# EAGLE design CHIP_tzatziffy_v7 (EAGLE 7.7.0)
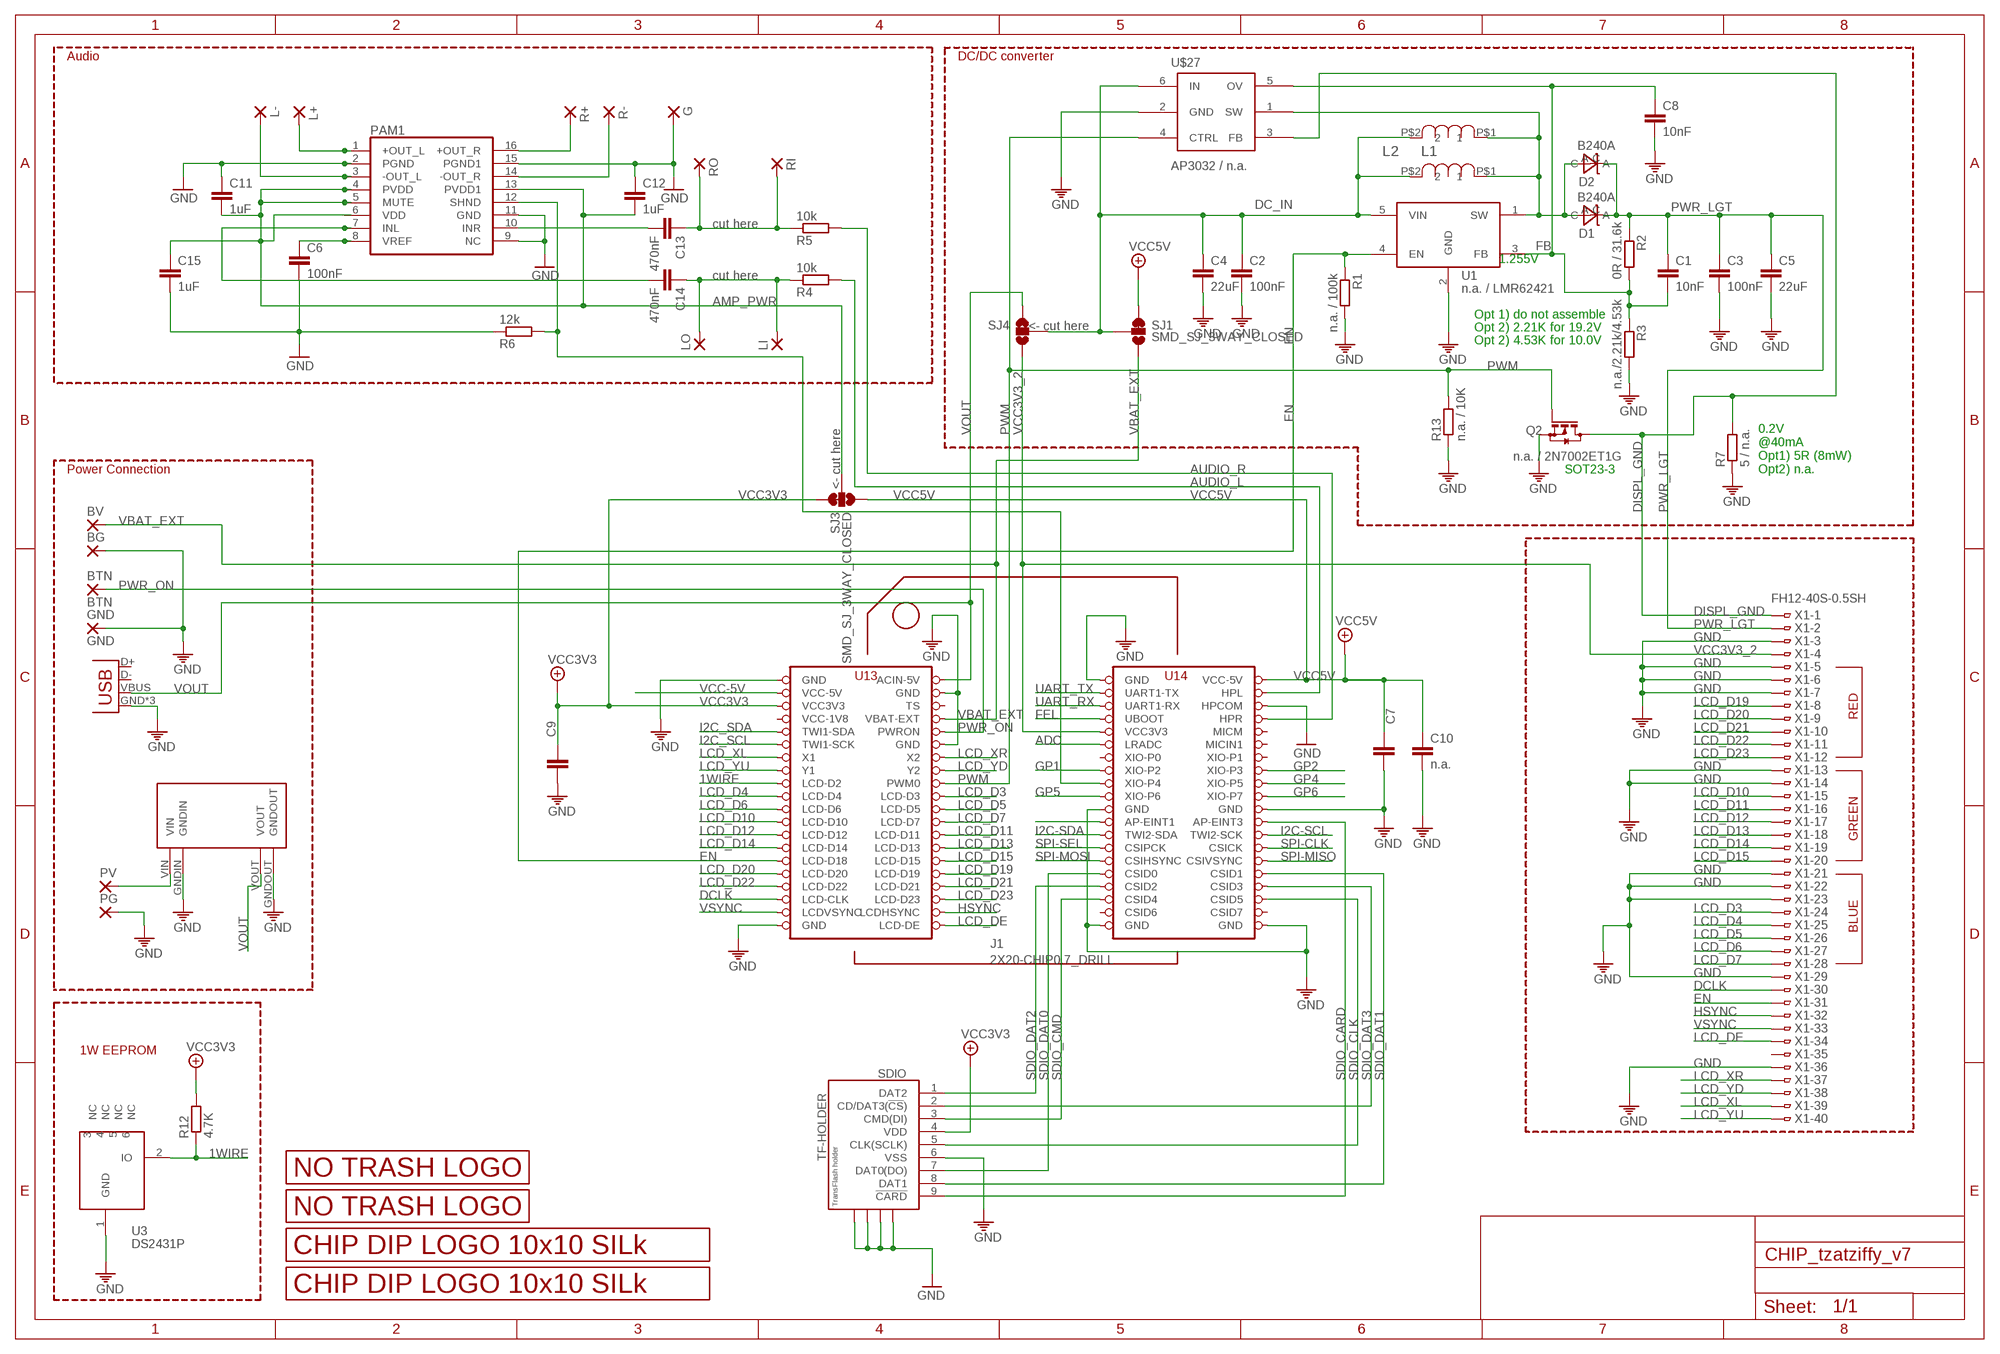
[diagram p0: schematic, sheet 1]

## Parts
BG  1,6/0,8  [1,6/0,8]
BTN  BTN  SMD2  [SMD1,27-2,54]
BV  1,6/0,8  [1,6/0,8]
C1  10nF  C-EUC0805  [C0805]
C2  100nF  C-EUC0805  [C0805]
C3  100nF  C-EUC0805  [C0805]
C4  22uF  C-EUC1206  [C1206]
C5  22uF  C-EUC1206  [C1206]
C6  100nF  C-EUC0805  [C0805]
C7  n.a.  C-EUC0805  [C0805]
C8  10nF  C-EUC0805  [C0805]
C9  n.a.  C-EUC0805  [C0805]
C10  n.a.  C-EUC0805  [C0805]
C11  1uF  C-EUC0805  [C0805]
C12  1uF  C-EUC0805  [C0805]
C13  470nF  C-EUC0805  [C0805]
C14  470nF  C-EUC0805  [C0805]
C15  1uF  C-EUC0805  [C0805]
D1  B240A  DIODE_SCHTKY_B240  [DO-214AC]
D2  B240A  DIODE_SCHTKY_B240  [DO-214AC]
G  1,6/0,8  [1,6/0,8]
GND  GND  SMD2  [SMD1,27-2,54]
J1  2X20-CHIP0.7_DRILL  [2X20CHIP_NOOFFSET-TH_0.7]
L1  SRN6045-100M  [SRN6045]
L2  SRN6045-100M  [SRN6045]
L+  1,6/0,8  [1,6/0,8]
L-  1,6/0,8  [1,6/0,8]
LI  1,6/0,8  [1,6/0,8]
LO  1,6/0,8  [1,6/0,8]
PAM1  PAM8403  [SOP-16]
PG  1,6/0,8  [1,6/0,8]
PV  1,6/0,8  [1,6/0,8]
Q2  n.a. / 2N7002ET1G  BSS123  [SOT23]
R1  n.a. / 100k  R-EU_M0805  [M0805]
R2  0R / 31.6k  R-EU_M0805  [M0805]
R3  n.a./2.21k/4.53k  R-EU_M0805  [M0805]
R4  10k  R-EU_R0805  [R0805]
R5  10k  R-EU_R0805  [R0805]
R6  12k  R-EU_R0805  [R0805]
R7  5 / n.a.  R-EU_M0805  [M0805]
R12  4.7K  R-EU_M0805  [M0805]
R13  n.a. / 10K  R-EU_M0805  [M0805]
R+  1,6/0,8  [1,6/0,8]
R-  1,6/0,8  [1,6/0,8]
RI  1,6/0,8  [1,6/0,8]
RO  1,6/0,8  [1,6/0,8]
SDIO  TF-HOLDER  [TF-PULL]
SJ1  SMD_SJ_3WAY_CLOSED  [SMD_SJ_3WAY_CLOSED]
SJ3  SMD_SJ_3WAY_CLOSED  [SMD_SJ_3WAY_CLOSED]
SJ4  SMD_SJ_3WAY_OPENT  [SMD_SJ_3WAY_OPEN]
U1  n.a. / LMR62421  LMR62421  [SOT23-5]
U3  DS2431P  [TSOC6]
U$2  LOGO_10X10_SILK  [LOGO2_10X10_SILK]
U$3  LOGO_NO_TRASHROHS  [LOGO_ROHS_SYM]
U$4  LOGO_NO_TRASHNO_TRASH  [LOGO_ROHS_NO_TRASH]
U$5  LOGO_10X10_SILK  [LOGO2_10X10_SILK]
U$10  MP1584EN_FRAMELESS  [MP1584EN_FRAMELESS]
U$27  AP3032 / n.a.  AP3032  [SOT23-6]
USB  USBUSB-MICROB-SMT-DIP  [USB-MICROB-SMT-DIP]
X1  FH12-40S-0.5SH  [FH12-40S-0.5SH]

## Nets
1WIRE: J1.LCD-D2 R12.1 U3.2(IO)
ADC: J1.LRADC
AMP_PWR: C11.2 C12.2 C15.1 PAM1.4(PVDD) PAM1.5(MUTE) PAM1.6(VDD) PAM1.13(PVDD1) SJ3.2
AUDIO_L: J1.HPL R4.2
AUDIO_R: J1.HPR R5.2
DC_IN: C2.1 C4.1 L1.P$2 L2.P$2 SJ1.2 SJ4.2 U1.5(VIN) U$27.6(IN)
DCLK: J1.LCD-CLK X1.30
DISPL_GND: Q2.3(D) R7.2 U$27.3(FB) X1.1
EN: J1.LCD-D18 R1.1 U1.4(EN) X1.31
FB: C1.2 C8.1 R2.2 R3.1 U1.3(FB) U$27.5(OV)
FEL: J1.FEL(UBOOT)
GND: BG.1(P) C2.2 C3.2 C4.2 C5.2 C6.2 C7.2 C8.2 C9.2 C10.2 C11.1 C12.1 C15.2 G.1(P) GND.1(P) J1.GND@1(GND) J1.GND@2(GND) J1.GND@3(GND) J1.GND@4(GND) J1.GND@5(GND) J1.GND@6(GND) J1.GND@7(GND) J1.GND@8(GND) J1.GND@10(GND) J1.HPCOM PAM1.2(PGND) PAM1.9(NC) PAM1.11(GND) PAM1.15(PGND1) PG.1(P) Q2.2(S) R1.2 R3.2 R6.1 R7.1 R13.1 SDIO.6(VSS) SDIO.S1 SDIO.S2 SDIO.S3 SDIO.S4 U1.2(GND) U3.1(GND) U$10.GNDIN U$10.GNDOUT U$27.2(GND) USB.GND USB.MT1(GND) USB.MT2(GND) X1.3 X1.5 X1.6 X1.7 X1.13 X1.14 X1.21 X1.22 X1.23 X1.29 X1.36
GP1: J1.XIO-P2
GP2: J1.XIO-P3
GP3: J1.XIO-P4 PAM1.12(SHND) R6.2
GP4: J1.XIO-P5
GP5: J1.XIO-P6
GP6: J1.XIO-P7
HSYNC: J1.LCD-HSYNC(LCDHSYNC) X1.32
I2C-SCL: J1.TWI2-SCK
I2C-SDA: J1.TWI2-SDA
I2C_SCL: J1.TWI1-SCK
I2C_SDA: J1.TWI1-SDA
INL: C14.2 PAM1.7(INL)
INR: C13.2 PAM1.10(INR)
KPD_INT: J1.AP-EINT1
L+OUT: L+.1(P) PAM1.1(+OUT_L)
L-OUT: L-.1(P) PAM1.3(-OUT_L)
LCD_D3: J1.LCD-D3 X1.24
LCD_D4: J1.LCD-D4 X1.25
LCD_D5: J1.LCD-D5 X1.26
LCD_D6: J1.LCD-D6 X1.27
LCD_D7: J1.LCD-D7 X1.28
LCD_D10: J1.LCD-D10 X1.15
LCD_D11: J1.LCD-D11 X1.16
LCD_D12: J1.LCD-D12 X1.17
LCD_D13: J1.LCD-D13 X1.18
LCD_D14: J1.LCD-D14 X1.19
LCD_D15: J1.LCD-D15 X1.20
LCD_D19: J1.LCD-D19 X1.8
LCD_D20: J1.LCD-D20 X1.9
LCD_D21: J1.LCD-D21 X1.10
LCD_D22: J1.LCD-D22 X1.11
LCD_D23: J1.LCD-D23 X1.12
LCD_DE: J1.LCD-DE X1.34
LCD_XL: J1.X1 X1.39
LCD_XR: J1.X2 X1.37
LCD_YD: J1.Y2 X1.38
LCD_YU: J1.Y1 X1.40
N$38: C6.1 PAM1.8(VREF)
N$41: C14.1 LI.1(P) LO.1(P) R4.1
N$43: C13.1 R5.1 RI.1(P) RO.1(P)
PWM: J1.PWM0 Q2.1(G) R13.2 U$27.4(CTRL)
PWR_IN: PV.1(P) U$10.VIN
PWR_LGT: C1.1 C3.1 C5.1 D1.C D2.C R2.1 X1.2
PWR_ON: BTN.1(P) J1.PWRON
R+OUT: PAM1.16(+OUT_R) R+.1(P)
R-OUT: PAM1.14(-OUT_R) R-.1(P)
SDIO_CARD: J1.AP-EINT3 SDIO.9(!CARD)
SDIO_CLK: J1.CSID5 SDIO.5(CLK(SCLK))
SDIO_CMD: J1.CSID4 SDIO.3(CMD(DI))
SDIO_DAT0: J1.CSID0 SDIO.7(DAT0(DO))
SDIO_DAT1: J1.CSID1 SDIO.8(DAT1)
SDIO_DAT2: J1.CSID2 SDIO.1(DAT2)
SDIO_DAT3: J1.CSID3 SDIO.2(CD/DAT3(!CS!))
SPI-CLK: J1.CSICK
SPI-MISO: J1.CSIVSYNC
SPI-MOSI: J1.CSIHSYNC
SPI-SEL: J1.CSIPCK
UART_RX: J1.UART1-RX
UART_TX: J1.UART1-TX
VBAT_EXT: BV.1(P) J1.BAT(VBAT-EXT) SJ1.3
VCC3V3: C9.1 J1.VCC3V3 R12.2 SDIO.4(VDD) SJ3.1
VCC3V3_2: J1.VCC3V3@1(VCC3V3) SJ4.3 X1.4
VCC5V: C7.1 C10.1 J1.VCC5V@1(VCC-5V) SJ1.1 SJ3.3
VCC-5V: J1.VCC5V@0(VCC-5V)
VOUT: J1.CHG-IN(ACIN-5V) SJ4.1 U$10.VOUT USB.VBUS
VREG_OUTPUT: D1.A D2.A L1.P$1 L2.P$1 U1.1(SW) U$27.1(SW)
VSYNC: J1.LCD-VSYNC(LCDVSYNC) X1.33
Unconnected: J1.CSID6 J1.CSID7 J1.MICIN1 J1.MICM J1.TS J1.XIO-P0 J1.XIO-P1 U3.3(NC) U3.4(NC) U3.5(NC) U3.6(NC) USB.D+ USB.D- X1.35

## Notes on the sheet
- Audio | DC/DC converter
- cut here
- 1.255V
- cut here
- Opt 1) do not assemble
- <- cut here | Opt 2) 2.21K for 19.2V
- Opt 2) 4.53K for 10.0V
- <- cut here
- Power Connection | SOT23-3
- 0.2V
  @40mA
  Opt1) 5R (8mW)
  Opt2) n.a.
- RED
- GREEN
- BLUE
- 1W EEPROM

## Power pins joined to a net without a drawn wire
VCC-1V8: J1.VCC1V8(VCC-1V8)

## Library data of the parts
BG BV G L+ L- LI LO PG PV R+ R- RI RO = wirepad:1,6/0,8: THROUGH-HOLE PAD
BTN GND = wirepad:SMD2: SMD PAD
C1-C15 = rcl:C-EU: CAPACITOR, European symbol
D1 D2 = Keyboard v0_5:DIODE_SCHTKY_B240; DESCRIPTION: DIODE SMD General Purpose 400V 1A 1.4W RoHS DO-214AC; FOOTPRINT: DO-214AC; LINK: http://www.digikey.com/product-detail/en/B240A-13-F/B240A-FDICT-ND/717810; MFG: DIGIKEY; MFG_PN: B240A-FDICT-ND; PART_TYPE: DIODE; PRICE: 0.11; VENDOR: DIODES; VENDOR_PART_NUMBER: B240A-13-F
J1 = JKW_CHIP:2X20-CHIP: Through hole layout with chip reference
L1 L2 = Keyboard v0_5:SRN6045-100M; DESCRIPTION: power inductor 10uH 2.5A 58.6 mohm; FOOTPRINT: SRN6045; LINK: http://www.digikey.com/product-detail/en/SRN6045-100M/SRN6045-100MTR-ND/2756120; MFG: DIGIKEY; MFG_PN: SRN6045-100MTR-ND; PART_TYPE: IND; PRICE: 0.15; TOLLERANCE: ±20%; VENDOR: BOURNS; VENDOR_PART_NUMBER: SRN6045-100M
PAM1 = JKW_CHIP:PAM8403: Dual channel audio amplifier IC - PAM8403
Q2 = transistor-small-signal:BSS123: N-CHANNEL MOS FET
R1-R7 R12 R13 = rcl:R-EU_: RESISTOR, European symbol
SDIO = JKW_CHIP:TF-HOLDER: TF / Micro SD socket is PUSH-PUSH type, the card can be pushed into and auto locked and pushed out by simply press the card. Surface Mounting type.
SJ1 SJ3 = JKW_CHIP:SMD_SJ_3WAY_CLOSED
SJ4 = JKW_CHIP:SMD_SJ_3WAY_OPEN: Solder Jumper 2 way solder jumper
U1 = PocketCHIP-Components-v0.7:LMR62421; DESCRIPTION: dc/dc step up, 2.1A, 1.6mhz, SOT-23-5; FOOTPRINT: SOT23-5; LINK: http://www.digikey.com/product-detail/en/LMR62421XMFE%2FNOPB/LMR62421XMFE%2FNOPBCT-ND/2777085; MFG: DIGIKEY; MFG_PN: LMR62421XMFE/NOPBCT-ND; PART_TYPE: IC; PRICE: 0.8; VENDOR: TEXAS INSTRUMENTS; VENDOR_PART_NUMBER: LMR62421XMFE/NOPB
U3 = Keyboard v0_5:DS2431: 1024-Bit EEPROM This chip provides a 4x256 Bit EEPROM, which can be programmed@5V. Write protection and OTP emulation are available, too. Author: Jan Kandziora <jjj@gmx.de>; DESCRIPTION: IC, 1024-Bit, 1-Wire EEPROM, TSOC6; FOOTPRINT: TSOC6; LINK: http://www.digikey.com/product-detail/en/DS2431P%2BT%26R/DS2431P%2BT%26RCT-ND/3647900; MFG: DIGIKEY; MFG_PN: DS2431P+T&RCT-ND; PART_TYPE: IC; PRICE: 0.98; VENDOR: MAXIM; VENDOR_PART_NUMBER: DS2431P+T&R
U$2 U$5 = JKW_CHIP:LOGO_10X10_SILK
U$3 U$4 = JKW_CHIP:LOGO_NO_TRASH
U$10 = JKW_CHIP:MP1584EN_FRAMELESS
U$27 = JKW_CHIP:AP3032
USB = Spark:USB
X1 = Keyboard v0_5:FH12-40S-0.5S: 0.5mm Pitch Connectors For FPC/FFC Source: Data sheet <http://www.hirose.co.jp/cataloge_hp/e58605370.pdf>; DESCRIPTION: CON ffc smd, bottom contact 40pos, 0.50mm R/A; FOOTPRINT: FH12-40S-0.5SH; LINK: http://www.digikey.com/product-detail/en/FH12-40S-0.5SH(55)/HFJ140CT-ND/1110388; MFG: DIGIKEY; MFG_PN: HFJ140CT-ND; VENDOR: HIROSE; VENDOR_PART_NUMBER: FH12-40S-0.5SH(55)

## Board
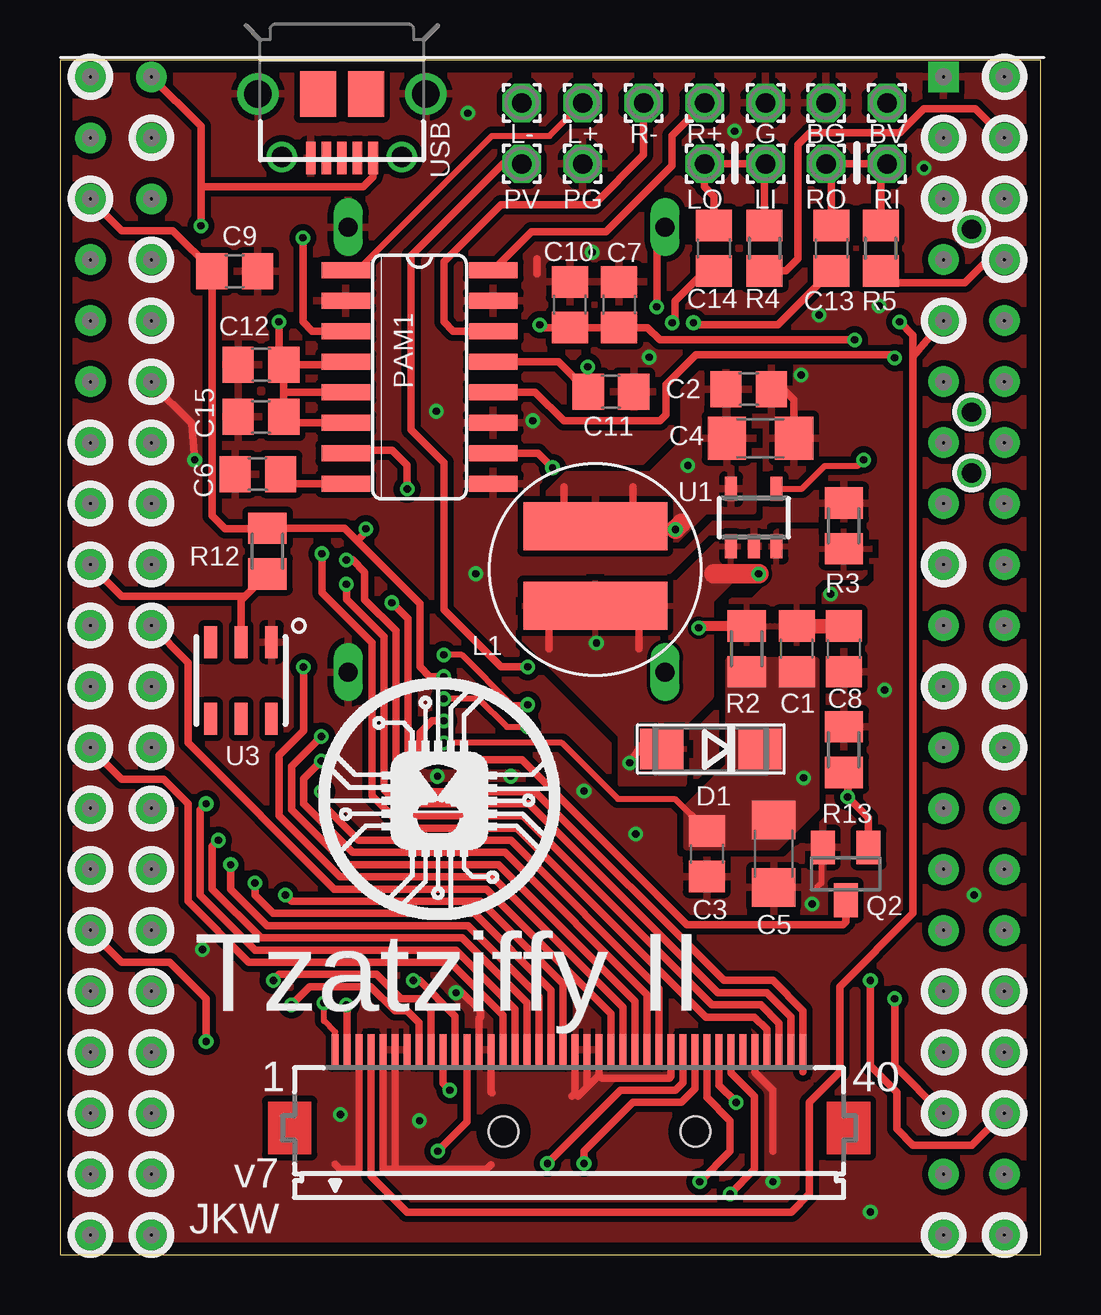
[diagram p1: board, top side]
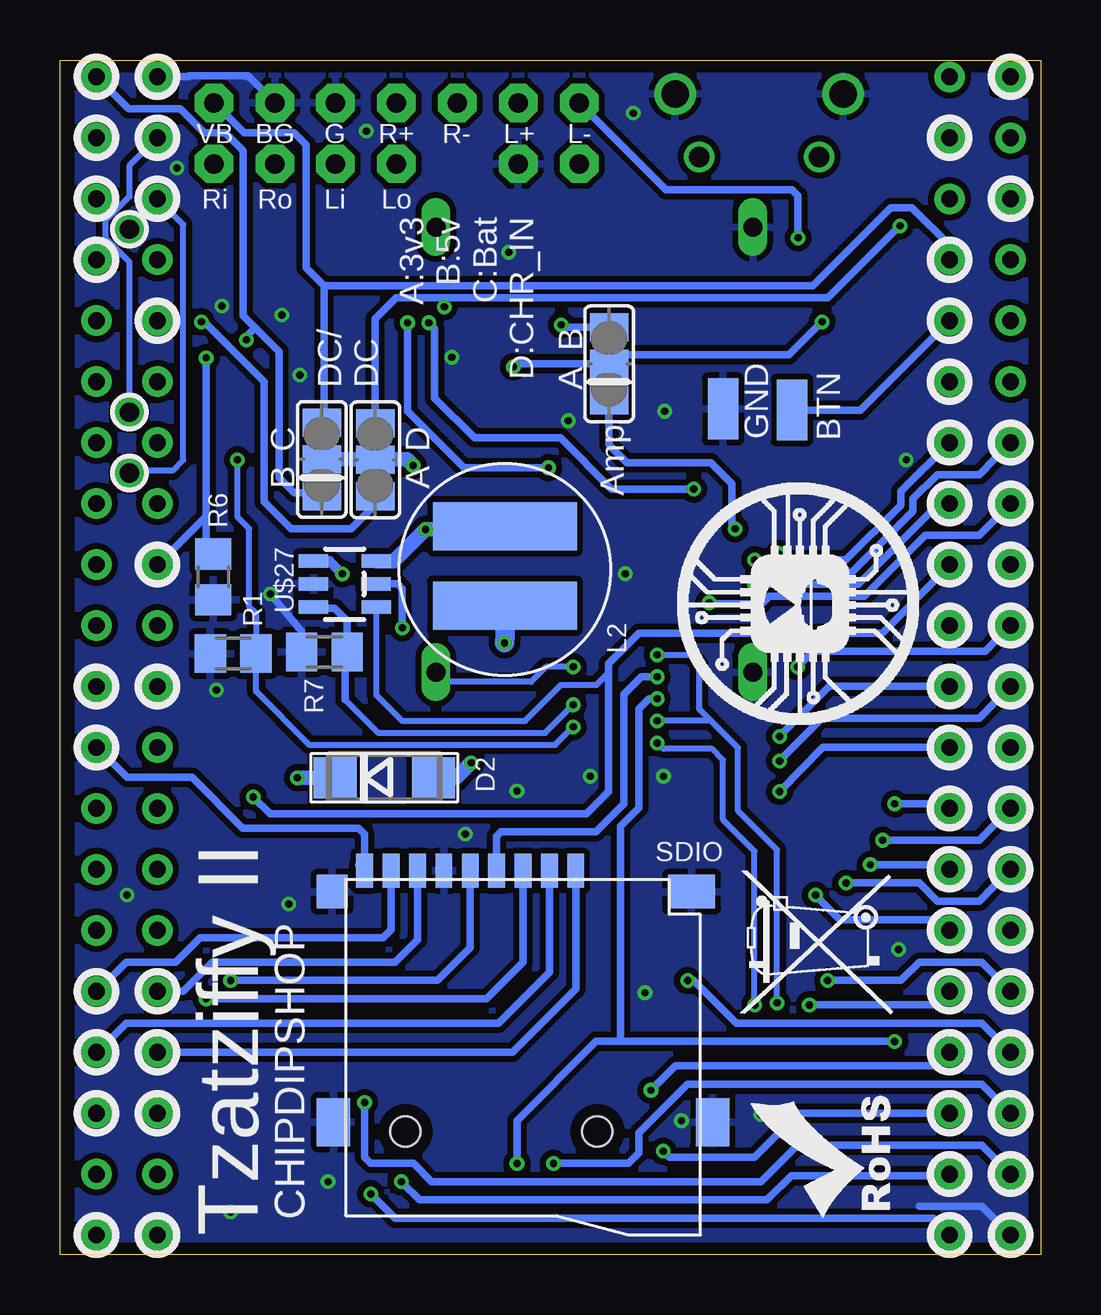
[diagram p2: board, bottom side, seen from below]

Size 40.89 x 49.78 mm. Coordinates in mm from the lower left corner, seen from the top.
Outline: 0,0 40.89,0 40.89,49.78 0,49.78 0,0
Copper layers (1*16): Top 0.035mm / dielectric 1.6mm / Bottom 0.035mm
Design rules "Elecrow_2-layer_PCB_eagle_rule": minimum track width 6mil, minimum drill 12mil, track to track 6mil, track to pad 6mil, pad to pad 6mil, via to via 8mil, smd to smd 0mil, copper to edge 20mil, drill to drill 10mil, minimum pad ring 6mil, minimum via ring 6mil, stop-mask expansion 0mil, vias tented up to drill 100mil, thermal gap 10mil

### Footprints (pad centres in the part's own frame; a part is rotated, then mirrored left to right if it is on the bottom)
1,6/0,8 = drill 0.813 pad 1.6 octagon: 1 0,0
SMD1,27-2,54 = smd 1.27 x 2.54: 1 0,0
C0805 = smd 1.3 x 1.5: 1 -0.95,0; 2 0.95,0
C1206 = smd 1.6 x 1.8: 1 -1.4,0; 2 1.4,0
DO-214AC = smd 1.8 x 1.7: A 2.05,0; C -2.05,0
2X20CHIP_NOOFFSET-TH_0.7 = drill 0.7 pad 1.27: AP-EINT1 15.22,-3.75; AP-EINT3 17.76,-3.75; BAT -17.8,16.57; CHG-IN -17.8,24.19; CSICK 17.76,-8.83; CSID0 15.22,-13.91; CSID1 17.76,-13.91; CSID2 15.22,-16.45; CSID3 17.76,-16.45; CSID4 15.22,-18.99; CSID5 17.76,-18.99; CSID6 15.22,-21.53; CSID7 17.76,-21.53; CSIHSYNC 15.22,-11.37; CSIPCK 15.22,-8.83; CSIVSYNC 17.76,-11.37; FEL 15.22,16.57; GND@1 -17.8,11.49; GND@2 -20.34,-24.07; GND@4 17.76,-1.21; GND@5 17.76,-24.07; GND@6 15.22,-24.07; GND@7 15.22,-1.21; GND@10 -17.8,21.65; HPCOM 17.76,19.11; HPL 17.76,21.65; HPR 17.76,16.57; LCD-CLK -20.34,-18.99; LCD-D2 -20.34,3.87; LCD-D3 -17.8,1.33; LCD-D4 -20.34,1.33; LCD-D5 -17.8,-1.21; LCD-D6 -20.34,-1.21; LCD-D7 -17.8,-3.75; LCD-D10 -20.34,-3.75; LCD-D11 -17.8,-6.29; LCD-D12 -20.34,-6.29; LCD-D13 -17.8,-8.83; LCD-D14 -20.34,-8.83; LCD-D15 -17.8,-11.37; LCD-D18 -20.34,-11.37; LCD-D19 -17.8,-13.91; LCD-D20 -20.34,-13.91; LCD-D21 -17.8,-16.45; LCD-D22 -20.34,-16.45; LCD-D23 -17.8,-18.99; LCD-DE -17.8,-24.07; LCD-HSYNC -17.8,-21.53; LCD-VSYNC -20.34,-21.53; LRADC 15.22,11.49; MICIN1 17.76,11.49; MICM 17.76,14.03; PWM0 -17.8,3.87; PWRON -17.8,14.03; TS -17.8,19.11; TWI1-SCK -20.34,11.49; TWI1-SDA -20.34,14.03; TWI2-SCK 17.76,-6.29; TWI2-SDA 15.22,-6.29; UART1-RX 15.22,19.11; UART1-TX 15.22,21.65; VCC1V8 -20.34,16.57; VCC3V3 -20.34,19.11; VCC3V3@1 15.22,14.03; VCC5V@0 -20.34,21.65; VCC5V@1 17.76,24.19; X1 -20.34,8.95; X2 -17.8,8.95; XIO-P0 15.22,8.95; XIO-P1 17.76,8.95; XIO-P2 15.22,6.41; XIO-P3 17.76,6.41; XIO-P4 15.22,3.87; XIO-P5 17.76,3.87; XIO-P6 15.22,1.33; XIO-P7 17.76,1.33; Y1 -20.34,6.41; Y2 -17.8,6.41 | drill 0.7 pad 1.27 square: GND@3 -20.34,24.19; GND@8 15.22,24.19
SRN6045 = smd 2 x 6: P$1 1.5,0; P$2 -1.8,0
SOP-16 = smd 0.66 x 2.032: 1 -4.445,-3.073; 2 -3.175,-3.073; 3 -1.905,-3.073; 4 -0.635,-3.073; 5 0.635,-3.073; 6 1.905,-3.073; 7 3.175,-3.073; 8 4.445,-3.073; 9 4.445,3.073; 10 3.175,3.073; 11 1.905,3.073; 12 0.635,3.073; 13 -0.635,3.073; 14 -1.905,3.073; 15 -3.175,3.073; 16 -4.445,3.073
SOT23 = smd 1 x 1.4: 1 -0.95,-1.1; 2 0.95,-1.1; 3 0,1.1
M0805 = smd 1.3 x 1.6: 1 -0.95,0; 2 0.95,0
R0805 = smd 1.3 x 1.5: 1 -0.95,0; 2 0.95,0
TF-PULL = smd 0.7 x 1.4: 1 -2.2,-7.62; 2 -1.1,-7.62; 3 0,-7.62; 4 1.1,-7.62; 5 2.2,-7.62; 6 3.3,-7.62; 7 4.4,-7.62; 8 5.5,-7.62; 9 6.6,-7.62 | smd 1.4 x 2: S1 -7.9,2.85; S2 7.9,2.85 | smd 1.28 x 1.4: S3 7.96,-6.75 | smd 1.95 x 1.4: S4 -7.025,-6.75 | hole 1.25: -3.1,3.25; 4.9,3.25
SMD_SJ_3WAY_CLOSED = smd 1.168 x 1.6: 1 -1.524,0; 2 0,0; 3 1.524,0
SMD_SJ_3WAY_OPEN = smd 1.168 x 1.6: 1 -1.524,0; 2 0,0; 3 1.524,0
SOT23-5 = smd 0.5 x 1: 1 -0.95,-1.2; 2 0,-1.2; 3 0.95,-1.2; 4 0.95,1.2; 5 -0.95,1.2
TSOC6 = smd 0.53 x 1.33: 1 -1.27,-1.6; 2 0,-1.6; 3 1.27,-1.6; 4 1.27,1.6; 5 0,1.6; 6 -1.27,1.6
MP1584EN_FRAMELESS = drill 0.8 long: GNDIN 1.778,14.986; GNDOUT 20.32,14.986; VIN 1.778,1.778; VOUT 20.32,1.778
SOT23-6 = smd 0.559 x 1.219: 1 -0.95,-1.3; 2 0,-1.3; 3 0.965,-1.3; 4 0.965,1.321; 5 0,1.3; 6 -0.95,1.321
USB-MICROB-SMT-DIP = smd 0.4 x 1.35: D+ 0,2.675; D- -0.65,2.675; GND 1.3,2.675; ID 0.65,2.675; VBUS -1.3,2.675 | drill 1.15 pad 1.7: MT1 -3.5,0; MT2 3.5,0 | drill 0.85 pad 1.25: MT3 -2.5,2.625; MT4 2.5,2.625 | smd 1.5 x 1.9: P$1 -1,0; P$2 1,0.01
FH12-40S-0.5SH = smd 0.3 x 1.3: 1 -9.75,3.25; 2 -9.25,3.25; 3 -8.75,3.25; 4 -8.25,3.25; 5 -7.75,3.25; 6 -7.25,3.25; 7 -6.75,3.25; 8 -6.25,3.25; 9 -5.75,3.25; 10 -5.25,3.25; 11 -4.75,3.25; 12 -4.25,3.25; 13 -3.75,3.25; 14 -3.25,3.25; 15 -2.75,3.25; 16 -2.25,3.25; 17 -1.75,3.25; 18 -1.25,3.25; 19 -0.75,3.25; 20 -0.25,3.25; 21 0.25,3.25; 22 0.75,3.25; 23 1.25,3.25; 24 1.75,3.25; 25 2.25,3.25; 26 2.75,3.25; 27 3.25,3.25; 28 3.75,3.25; 29 4.25,3.25; 30 4.75,3.25; 31 5.25,3.25; 32 5.75,3.25; 33 6.25,3.25; 34 6.75,3.25; 35 7.25,3.25; 36 7.75,3.25; 37 8.25,3.25; 38 8.75,3.25; 39 9.25,3.25; 40 9.75,3.25

### Placement (x,y rotation side)
BG  31.93,48 0 top
BTN  10.38,35.2 180 bottom
BV  34.47,48 0 top
C1  30.71,25.25 90 top
C2  28.71,36.08 0 top
C3  26.97,16.71 270 top
C4  29.2,34.03 0 top
C5  29.75,16.71 270 top
C6  8.25,32.53 180 top
C7  23.31,39.59 90 top
C8  32.67,25.25 270 top
C9  7.29,40.98 0 top
C10  21.25,39.59 90 top
C11  22.97,35.96 180 top
C12  8.38,37.08 0 top
C13  32.17,41.94 270 top
C14  27.26,41.94 270 top
C15  8.38,34.91 180 top
D1  27.13,21.08 180 top
D2  27.38,19.88 0 bottom
G  29.41,48 0 top
GND  13.25,35.24 180 bottom
J1  21.61,24.89 0 top
L1  22.32,28.55 270 top
L2  22.35,28.55 270 bottom
L+  21.79,48 0 top
L-  19.25,48 0 top
LI  29.41,45.46 0 top
LO  26.87,45.46 0 top
PAM1  14.99,36.58 270 top
PG  21.79,45.46 0 top
PV  19.25,45.46 0 top
Q2  32.75,15.88 180 top
R1  33.67,25.05 180 bottom
R2  28.63,25.25 90 top
R3  32.67,30.38 90 top
R4  29.37,41.94 270 top
R5  34.21,41.94 270 top
R6  34.5,28.25 90 bottom
R7  29.88,25.12 0 bottom
R12  8.65,29.32 90 top
R13  32.67,21.05 270 top
R+  26.87,48 0 top
R-  24.33,48 0 top
RI  34.47,45.46 0 top
RO  31.93,45.46 0 top
SDIO  21.59,8.38 180 bottom
SJ1  29.98,33.14 90 bottom
SJ3  18,37.12 90 bottom
SJ4  27.75,33.12 270 bottom
U1  28.92,30.72 0 top
U3  7.55,23.93 180 top
U$2  10.79,13.97 0 top
U$3  6.21,1.08 90 bottom
U$4  6.17,10.02 90 bottom
U$5  5.1,22.1 90 bottom
U$10  27,22.5 90 top
U$27  29.03,27.95 270 bottom
USB  11.75,48.38 180 top
X1  21.22,5.29 0 top

### Tracks (layer width: path | path; a pad name or v marks a point on that pad's centre or on a via)
1WIRE
  Top 0.305: J1.LCD-D2 2.58,27.43 7.71,27.43 | 7.71,27.43 R12.1 | U3.2 7.55,27.27 7.71,27.43
AMP_PWR  (via drill 0.3)
  Top 0.305: 9.46,37.21 C12.2 | PAM1.6 9.97,34.67 C15.1 9.33,35.88 | C12.2 9.33,35.88 | PAM1.4 11.79,37.08 C12.2 | v9.12,38.88 9.12,37.29 C12.2 | 18.02,37.25 PAM1.13 20.77,37.21 C11.2 21.62,35.74 22,36.12 v22,37 | PAM1.5 9.4,35.94 9.33,35.88
  Bottom 0.305: v9.12,38.88 10.5,37.5 17.62,37.5 SJ3.2 21.88,37.12 v22,37
AUDIO_L
  Top 0.305: 29,40.88 28.99,40.88 R4.2 29,41 30.25,41 30.75,41.5 30.75,46.25 31.25,46.75 35,46.75 36,47.75 38.16,47.75 J1.HPL
AUDIO_R
  Top 0.305: J1.HPR 38.67,41.46 37.71,40.51 34.19,40.51 R5.2
DC_IN  (via drill 0.3)
  Top 0.305: 21,32 21,31 | 23.88,32 23.88,31
  Top 0.813: v25.65,30.23 25.91,30.48
  Bottom 0.61: 22.52,29.77 22.32,29.98 22.35,29.98 L2.P$2 22.48,30.23 v25.65,30.23 26.98,28.9 U$27.6 | SJ1.2 27.77,33.14 | 27.77,33.14 SJ4.2 | 27.77,33.14 26.42,33.14 v26.17,32.89
  pour Top: 28.88,36.75 26.75,36.75 26,36 26,33.88 24.62,32.5 21.12,32.5 19.5,30.88 19.5,29.5 25.38,29.5 26.88,31 28.88,31
DCLK  (via drill 0.3)
  Top 0.305: X1.30 25.97,7.18 25.65,6.86 23.37,6.86 v20.32,3.81
  Bottom 0.305: J1.LCD-CLK 2.46,7.11 14.73,7.11 16.75,5.09 16.75,4.25 17.19,3.81 v20.32,3.81
DISPL_GND  (via drill 0.3)
  Top 0.254: X1.1 11.47,9.28 11,9.75 v11,10.5 | v16,25 16.75,25 18.83,22.92 v19.5,22.92
  Top 0.305: v16,22.25 15.5,22.25 15,21.75 15,21 15.38,20.62 19.25,20.62 26.12,13.75 32.62,13.75 32.75,13.88 Q2.3
  Bottom 0.254: v11,10.5 11,16.88 12.62,18.5 12.62,21.12 13.75,22.25 | 13.75,22.25 v16,22.25 | v16,25 14.62,25 14.25,24.62 14.25,22.75 13.75,22.25 | 30.38,26.94 U$27.3 | 29,23.12 27.62,21.75 20.67,21.75 v19.5,22.92
  Bottom 0.305: 29,23.12 29,25.05 R7.2 28.93,26.43 29.44,26.94 30.38,26.94
EN  (via drill 0.3)
  Top 0.254: v16,23.17 17.46,23.17 18.62,22 v19.5,22 | U1.4 30.92,31.92 31.88,32.88 33.25,32.88 v33.5,33.12
  Top 0.305: J1.LCD-D18 2.58,12.19 4.57,12.19 6.1,10.67 v6.1,8.89 | X1.31 26.47,6.91 25.91,6.35 23.88,6.35 21.84,4.32 v21.84,3.81
  Bottom 0.254: v33.5,33.12 33.5,30.75 33,30.25 33,27 32.73,26.73 R1.1 | 32.38,24.95 R1.1 | v19.5,22 20.25,21.25 30.5,21.25 32.73,23.48 R1.1
  Bottom 0.305: v6.1,8.89 17.53,8.89 | 17.53,8.89 17.53,17.85 16.75,18.62 16.75,22.75 16.33,23.17 v16,23.17 | 17.53,8.89 18.54,8.89 21.84,5.59 v21.84,3.81
FB  (via drill 0.3)
  Top 0.406: R2.2 26.7,26.2 v26.62,26.12
  Top 0.61: C8.1 C1.2
  Bottom 0.305: U$27.5 26.83,27.95 26.62,27.75 v26.62,26.12
  pour Top: 27.88,26.12 28,25.5 31.38,25.5 31.38,27.88 31.75,28.25 33.38,28.25 33.75,28.62 33.75,30 33.62,30.12 29.88,30.12 29.62,29.88 29.62,28 28.88,27.25 28,27.25 27.88,27.12
GND  (via drill 0.3, 0.8)
  Top 0.254: 31.56,15.31 31.75,15.5 31.75,16.43 Q2.2
  Top 0.305: 13.97,3.56 17.78,3.56 17.97,3.75 | PAM1.2 12.04,39.88 | 3.81,36.32 5.49,34.64 v5.62,33.12 | 11.47,3.77 11.68,3.56 12.45,3.56 12.47,3.58 X1.3 | 13.97,3.56 13.46,3.56 13.47,3.57 X1.5 | X1.6 13.97,3.56 | X1.36 28.97,7.6 29.72,6.86 29.72,4.32 | 16.76,10.92 17.53,10.16 17.53,9.91 17.47,9.85 X1.13 | X1.29 25.47,7.44 25.4,7.37 22.59,7.37 22.47,7.49 | X1.21 21.47,6.74 21.34,6.6 | X1.23 22.47,7.49 | 22.47,7.49 21.97,6.99 | 21.97,6.99 21.59,6.6 | X1.22 21.97,6.99 | X1.14 17.97,6.78 18,6.75 | C4.2 30.6,35.63 30.16,36.08 C2.2 | 19.88,40.88 19.88,41.5
  Bottom 0.305: J1.GND@2 2.46,2.03 5.08,2.03 | 33.01,49.08 33.08,49.08 | BG.1 33.05,49.12 35.5,49.12 35.54,49.08 J1.GND@8 | R7.1 30.82,25.99 v32.13,27.54
  other vias: 24.57,37.4 17.34,28.38 16.99,47.57 21.84,19.32 33.78,1.78 29.72,3.05 24,17.53 38.1,14.99 18.8,19.94 15.74,19.94 14.99,5.59 16.51,10.92 11.68,5.84 38,42.73 34.38,23.54 30.89,36.66 19.71,34.75 28.12,46.82 5.93,12.72 22.19,41.77 15.69,35.15 31.64,39.16 34.15,39.54 36.02,45.29 31.35,14.61
  pour Bottom (isolate 0.254, rank 3): 0.51,49.78 40.13,49.78 40.13,0.25 0.51,0.25
  pour Top (isolate 0.254, rank 3): 0.51,49.78 40.13,49.78 40.13,0.25 0.51,0.25
GP3  (via drill 0.3)
  Top 0.305: v34.8,37.38 34.67,37.5 26.5,37.5 25.25,36.25 25.25,35 25,34.75 21,34.75 19.81,35.94 PAM1.12
  Bottom 0.305: v34.8,37.38 34.8,30.77 | 34.8,30.77 J1.XIO-P4 | R6.2 34.8,29.5 34.8,30.77
HSYNC  (via drill 0.3)
  Top 0.305: 26.97,3.35 v26.67,3.05 27.94,4.31 27.94,5.59 26.97,6.56 X1.32
  Bottom 0.305: J1.LCD-HSYNC 3.85,3.3 10.41,3.3 11.43,2.29 25.91,2.29 v26.67,3.05
INL  (via drill 0.3)
  Top 0.305: PAM1.7 12.04,33.53 13.85,33.53 14.47,32.9 v14.47,31.9 | v25.52,38.83 25.62,38.94 25.62,39.73 26.88,40.99 C14.2
  Bottom 0.305: v14.47,31.9 17.9,31.9 20.04,34.04 23.62,34.04 25.27,35.69 25.27,38.58 v25.52,38.83
INR  (via drill 0.3)
  Top 0.305: v26.4,38.83 26.49,38.75 29.93,38.75 C13.2 | PAM1.10 19.92,33.4 v20.53,32.79
  Bottom 0.305: v26.4,38.83 26.4,35.15 24.04,32.79 v20.53,32.79
L+OUT
  Top 0.254: L+.1 20.41,46.62 18,46.62 12.4,41.02 PAM1.1
  Top 0.305: PAM1.1 12.5,41.02
L-OUT  (via drill 0.3)
  Top 0.305: PAM1.3 10.52,38.48 10.12,38.88 v10.12,42.38
  Bottom 0.305: v10.12,42.38 10.12,44.12 10.38,44.38 15.62,44.38 L-.1
LCD_D3
  Top 0.305: J1.LCD-D3 5.33,24.68 5.33,21.34 11.43,15.24 17.78,15.24 22.97,10.05 X1.24
  Bottom 0.305: 3.85,26.16 J1.LCD-D3
LCD_D4  (via drill 0.3)
  Top 0.305: X1.25 23.47,10.31 18.03,15.75 11.68,15.75 9.14,18.29 9.14,20.82 10.15,21.83 v10.15,24.5
  Bottom 0.305: J1.LCD-D4 2.33,25.15 9.5,25.15 v10.15,24.5
LCD_D5  (via drill 0.3)
  Top 0.305: X1.26 23.97,10.57 18.29,16.26 11.94,16.26 9.65,18.54 9.65,20.35 v10.9,21.6
  Bottom 0.305: J1.LCD-D5 8.82,23.68 v10.9,21.6
LCD_D6  (via drill 0.3)
  Top 0.305: X1.27 24.47,10.83 18.54,16.76 12.19,16.76 10.16,18.8 10.16,19.84 v10.9,20.58
  Bottom 0.305: J1.LCD-D6 2.58,22.35 9.13,22.35 v10.9,20.58
LCD_D7  (via drill 0.3)
  Top 0.305: X1.28 24.97,11.1 18.8,17.27 12.45,17.27 10.92,18.8 v10.9,19.3
  Bottom 0.305: J1.LCD-D7 9.08,21.14 v10.9,19.3
LCD_D10
  Top 0.305: J1.LCD-D10 2.58,19.81 4.32,19.81 5.33,18.8 5.33,14.73 7.87,12.19 16.26,12.19 18.47,9.98 X1.15
LCD_D11  (via drill 0.3)
  Top 0.305: v6.1,18.8 5.84,18.54 5.84,14.99 8.13,12.7 16.51,12.7 18.97,10.24 X1.16
  Bottom 0.305: v6.1,18.8 3.98,18.8 J1.LCD-D11
LCD_D12  (via drill 0.3)
  Top 0.305: v6.6,17.27 6.35,17.02 6.35,15.24 8.38,13.21 16.76,13.21 19.47,10.5 X1.17
  Bottom 0.305: J1.LCD-D12 2.58,17.27 v6.6,17.27
LCD_D13  (via drill 0.3)
  Top 0.305: v7.11,16.26 7.11,15.24 8.64,13.72 17.02,13.72 19.97,10.76 X1.18
  Bottom 0.305: v7.11,16.26 3.98,16.26 J1.LCD-D13
LCD_D14  (via drill 0.3)
  Top 0.305: X1.19 20.47,11.02 17.27,14.22 8.89,14.22 8.13,14.99 v8.13,15.49
  Bottom 0.305: J1.LCD-D14 2.58,14.73 4.32,14.73 5.08,15.49 v8.13,15.49
LCD_D15  (via drill 0.3)
  Top 0.305: X1.20 20.97,11.29 17.53,14.73 9.65,14.73 v9.4,14.99
  Bottom 0.305: v9.4,14.99 8.38,13.97 4.24,13.97 J1.LCD-D15
LCD_D19  (via drill 0.3)
  Top 0.305: X1.8 14.97,9.67 14.48,10.16 13.97,10.16 12.95,11.18 10.41,11.18 v9.65,10.41
  Bottom 0.305: v9.65,10.41 4.36,10.41 J1.LCD-D19
LCD_D20  (via drill 0.3)
  Top 0.305: X1.9 15.47,10.18 14.99,10.67 14.22,10.67 13.21,11.68 9.14,11.68 v8.89,11.43
  Bottom 0.305: J1.LCD-D20 2.46,12.19 5.08,12.19 5.84,11.43 v8.89,11.43
LCD_D21  (via drill 0.3)
  Top 0.305: v16.26,6.86 15.97,7.14 X1.10
  Bottom 0.305: J1.LCD-D21 4.36,7.87 15.24,7.87 v16.26,6.86
LCD_D22  (via drill 0.3)
  Top 0.305: X1.11 16.47,9.94 14.99,11.43 v14.73,11.43
  Bottom 0.305: J1.LCD-D22 2.46,9.65 12.7,9.65 14.48,11.43 v14.73,11.43
LCD_D23  (via drill 0.3)
  Top 0.305: 16.97,8.17 X1.12 16.97,5.54 v15.75,4.32
  Bottom 0.305: J1.LCD-D23 10.1,5.9 11.94,4.06 15.49,4.06 v15.75,4.32
LCD_DE  (via drill 0.3)
  Top 0.305: X1.34 27.97,7.59 28.96,6.6 28.96,3.56 v27.94,2.54
  Bottom 0.305: J1.LCD-DE 4.49,1.52 26.92,1.52 v27.94,2.54
LCD_XL  (via drill 0.3)
  Top 0.305: v11.94,28.96 12.19,28.96 12.7,28.45 12.7,27.3 14,26 14,19.62 14.83,18.8 19.56,18.8 27.43,10.92 29.46,10.92 30.47,9.91 X1.39
  Bottom 0.305: J1.X1 2.58,32.51 4.32,32.51 5.33,31.5 5.33,30.99 7.87,28.45 11.43,28.45 v11.94,28.96
LCD_XR  (via drill 0.3)
  Top 0.305: X1.37 29.47,9.39 28.96,9.91 26.92,9.91 19.05,17.78 14.35,17.78 13,19.12 13,25.5 10.92,27.58 v10.92,29.21
  Bottom 0.305: v10.92,29.21 10.67,28.96 8.13,28.96 5.84,31.24 5.84,31.81 J1.X2
LCD_YD  (via drill 0.3)
  Top 0.305: X1.38 29.97,9.65 29.21,10.41 27.18,10.41 19.3,18.29 14.59,18.29 13.5,19.38 13.5,25.75 11.94,27.31 v11.94,27.94
  Bottom 0.305: J1.Y2 3.85,31.24 4.32,31.24 7.62,27.94 v11.94,27.94
LCD_YU  (via drill 0.3)
  Top 0.305: 30.97,7.64 X1.40 30.97,10.18 29.72,11.43 27.69,11.43 19.81,19.3 15.07,19.3 14.5,19.88 14.5,26.51 v13.84,27.17
  Bottom 0.305: J1.Y1 2.58,29.97 4.83,29.97 7.37,27.43 11.32,27.43 11.62,27.12 13.79,27.12 v13.84,27.17
N$38
  Top 0.305: C6.1 9.6,32.13 PAM1.8
N$41
  Top 0.305: C14.1 27.26,44.12 26.87,44.51 LO.1 LI.1 29.37,45.42 R4.1
N$43
  Top 0.305: RO.1 RI.1 34.21,45.2 R5.1 | 31.92,45.45 RO.1 | C13.1 32.17,45.22 RO.1
PWM  (via drill 0.3)
  Top 0.305: Q2.1 33.7,18.21 v32.84,19.07 32.84,19.94 R13.2
  Bottom 0.254: 32.69,19.05 v32.84,19.07 | U$27.4 27.71,23.34 26.62,22.25 21.5,22.25 20,23.75 18.53,23.75 18.03,24.25
  Bottom 0.305: J1.PWM0 3.79,28.72 6.6,25.91 16.76,25.91 18.03,24.64 18.03,24.25 18.03,19.3 18.95,18.38 32.14,18.38 v32.84,19.07
PWR_IN  (via drill 0.3)
  Top 0.305: PV.1 18.46,45.46 14.62,41.62 14.62,34.38 16,33 16,26.88 18.38,24.5 v19.5,24.5
  Bottom 0.254: 24.94,24 U$10.VIN 24.82,23.88 21.25,23.88 20.62,24.5 v19.5,24.5
PWR_LGT  (via drill 0.3)
  Top 0.254: 26.56,18.06 25.63,19 23.25,19 20.92,21.33 v16,21.33
  Top 0.305: X1.2 11.97,10.38 v11.94,10.41 | 26.31,18.31 26.56,18.06 C3.1
  Bottom 0.254: v11.94,10.41 11.94,16.81 13.25,18.12 13.25,20.62 13.72,21.08 15.73,21.08 v16,21.33
  Bottom 0.61: D2.C v31,19.88
  pour Top (no thermals): 27.88,24.75 31.5,24.75 31.5,18.62 29.88,17 26.12,17 26.12,18.62 27.88,20.38
PWR_ON
  Bottom 0.305: J1.PWRON 7.53,35.2 BTN.1
R+OUT
  Top 0.254: 18.27,41.02 PAM1.16
  Top 0.305: 18.4,41.02 PAM1.16 19.66,42.62 22.75,42.62 25.5,45.38 25.5,46.62 R+.1
R-OUT
  Top 0.305: PAM1.14 16.39,38.48 16,38.88 16,41.38 18.38,43.75 22.25,43.75 24.33,45.83 R-.1
SDIO_CARD
  Bottom 0.305: 28.45,16.26 SDIO.9 28.19,17.53 28.45,17.78 33.27,17.78 35.39,19.89 38.1,19.89 J1.AP-EINT3
SDIO_CLK  (via drill 0.3)
  Top 0.305: J1.CSID5 38.02,4.57 35.55,4.57 34.88,5.25 34.88,6.78 33.78,7.87 v33.78,11.43
  Bottom 0.305: SDIO.5 23.79,12.79 25.15,11.43 v33.78,11.43
SDIO_CMD  (via drill 0.3)
  Top 0.305: v34.8,10.67 34.8,7.87 36.77,5.9 J1.CSID4
  Bottom 0.305: SDIO.3 21.59,12.19 23.11,10.67 v34.8,10.67
SDIO_DAT0
  Bottom 0.305: SDIO.7 25.99,13.13 26.92,12.19 34.54,12.19 35.75,10.98 J1.CSID0
SDIO_DAT1
  Bottom 0.305: SDIO.8 27.09,13.55 27.43,13.21 35.05,13.21 36.07,12.19 38.14,12.19 J1.CSID1
SDIO_DAT2
  Bottom 0.305: SDIO.1 19.39,11.09 22.04,8.44 J1.CSID2
SDIO_DAT3
  Bottom 0.305: SDIO.2 20.49,11.77 22.61,9.65 38.14,9.65 J1.CSID3
UART_RX  (via drill 0.8)
  Bottom 0.254: J1.UART1-RX 35.75,42.92 35.75,33.12 36.2,32.67 37.9,32.67 v38,32.57
UART_TX  (via drill 0.8)
  Bottom 0.22: 38,44.08 39,43.08 | 39,42.38 38,41.38
  Bottom 0.254: J1.UART1-TX 38,45.37 38,44.08 | 39,43.08 39,42.38 | 38,41.38 v38,35.11
VBAT_EXT
  Bottom 0.305: SJ1.3 29.89,34.75 29.89,37.36 29.88,37.38 29.88,40.38 | J1.BAT 3.81,42.06 5.38,43.62 6.25,43.62 9.5,40.38 29.88,40.38 | BV.1 33.22,46.75 31.12,46.75 30.62,46.25 30.62,41.12 29.88,40.38
VCC3V3  (via drill 0.3)
  Top 0.305: J1.VCC3V3 2.58,42.67 4.7,42.67 6.33,41.04 C9.1 | 8.38,30.54 R12.2 | 6.1,41.22 C9.1 | 8.86,30.48 R12.2 | 8.64,30.29 R12.2 | 6.31,41 C9.1 | 12.38,29.75 12.25,29.88 11.86,30.27 R12.2 | R12.2 8.63,30.25 6.88,30.25 6.33,30.79 C9.1 | v12.75,30.25 12.75,30.12 12.38,29.75 | v16,24.09 15.41,24.09 15,24.5 15,27.12 12.38,29.75
  Bottom 0.305: SDIO.4 22.69,17.43 22.5,17.62 18.56,17.62 17.39,18.8 17.39,23.36 16.66,24.09 v16,24.09 | v12.75,30.25 12.88,30.38 12.88,32.12 13.75,33 17.25,33 18,33.75 SJ3.1
VCC3V3_2  (via drill 0.3)
  Top 0.305: 35.56,37.42 J1.VCC3V3@1 36.78,38.88 | 35.56,37.42 35.56,14.22 32.51,11.18 32.51,7.62 31.24,6.35 31.24,2.54 30.48,1.78 14.48,1.78 12.97,3.28 X1.4 | v35,38.88 35.56,38.31 35.56,37.42
  Bottom 0.305: v35,38.88 34.88,38.88 32.38,36.38 32.38,31.38 31.25,30.25 28.75,30.25 27.75,31.25 SJ4.3
VCC5V  (via drill 0.3)
  Top 0.305: v20,38.75 20.11,38.64 C10.1 C7.1 24.49,38.64 25,38.12 v33.12,38.12
  Bottom 0.305: 30,31.6 SJ1.1 30.11,31.75 31.12,31.75 31.75,32.38 31.75,37.62 32.75,38.62 | 19.77,38.65 v20,38.75 19.9,38.65 SJ3.3 | v33.12,38.12 33.12,38.25 32.75,38.62 | 32.75,38.62 33.25,39.12 33.25,46 34,46.75 34.88,46.75 35.88,47.75 38.04,47.75 J1.VCC5V@1
VOUT  (via drill 0.3)
  Top 0.305: USB.VBUS 13.05,44.92 12.62,44.5 5.88,44.5 | 5.88,44.5 5.88,47.02 J1.CHG-IN | v5.88,42.88 5.88,44.5 | v24.88,39.5 24.88,42.47 U$10.VOUT
  Bottom 0.305: SJ4.1 27.75,39 26.88,39.88 24.88,39.88 | v5.88,42.88 8.88,39.88 24.88,39.88 | v24.88,39.5 24.88,39.88
VREG_OUTPUT  (via drill 0.3)
  Top 0.305: v23.75,20.5 24.25,21.25 | 20.38,26.5 20.38,25.25 | 24.12,26.5 24.12,25.25
  Top 0.813: v29.12,28.38 27.25,28.38
  Bottom 0.406: U$27.1 29.65,28.9 v29.12,28.38
  Bottom 0.61: D2.A 24.38,19.88 v23.75,20.5
  Bottom 0.813: L2.P$1 22.35,25.76 v22.36,25.5
  pour Top: 19.38,28 25.75,28 27.62,29.88 28.25,29.88 28.25,28.38 27.12,27.25 27.12,23.25 26,22.12 26,19.62 23.38,19.62 23.38,21.62 19.38,25.62
VSYNC  (via drill 0.3)
  Top 0.305: X1.33 27.47,7.07 v28.19,6.35
  Bottom 0.305: J1.LCD-VSYNC 2.46,4.57 10.16,4.57 11.68,3.05 25.4,3.05 26.16,3.81 27.94,3.81 28.19,4.06 v28.19,6.35

### Text on the board
tNames: Tzatziffy II | 1 | 40 | v7 / JKW
bNames: L- | L+ | R- | R+ | G | BG | VB | Lo | Li | Ro | Ri | A:3v3 / B:5v / C:Bat / D:CHR_IN | B | A | DC/ / DC | D | C | A | B | Amp | CHIPDIPSHOP | Tzatziffy II